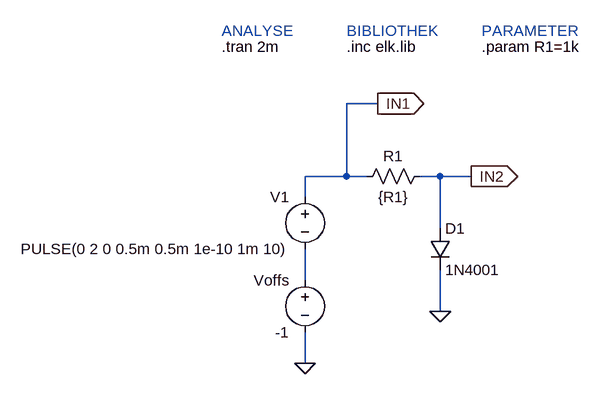
[diagram p0: schematic Activity_19_1N4001.asc]
Activity_19_1N4001.asc, the LTspice schematic file:
Version 4
SHEET 1 1408 680
WIRE -864 -16 -912 -16
WIRE -912 96 -912 -16
WIRE -912 96 -976 96
WIRE -880 96 -912 96
WIRE -768 96 -800 96
WIRE -720 96 -768 96
WIRE -976 128 -976 96
WIRE -768 176 -768 96
WIRE -976 256 -976 208
WIRE -768 304 -768 240
WIRE -976 384 -976 336
FLAG -768 304 0
FLAG -720 96 IN2
IOPIN -720 96 Out
FLAG -864 -16 IN1
IOPIN -864 -16 Out
FLAG -976 384 0
SYMBOL res -784 80 R90
WINDOW 0 0 56 VBottom 2
WINDOW 3 32 56 VTop 2
SYMATTR InstName R1
SYMATTR Value {R1}
SYMBOL diode -784 176 R0
SYMATTR InstName D1
SYMATTR Value 1N4001
SYMBOL voltage -976 112 M0
WINDOW 123 0 0 Left 0
WINDOW 39 0 0 Left 0
SYMATTR InstName V1
SYMATTR Value PULSE(0 2 0 0.5m 0.5m 1e-10 1m 10)
SYMBOL voltage -976 240 M0
SYMATTR InstName Voffs
SYMATTR Value -1
TEXT -704 -104 Left 2 !.param R1=1k
TEXT -1104 -104 Left 2 !.tran 2m
TEXT -912 -104 Left 2 !.inc elk.lib
TEXT -1104 -128 Left 2 ;ANALYSE
TEXT -912 -128 Left 2 ;BIBLIOTHEK
TEXT -704 -128 Left 2 ;PARAMETER

The netlist it stands for:
* Activity_19_1N4001.asc
R1 IN2 IN1 {R1}
D1 IN2 0 1N4001
V1 IN1 N001 PULSE(0 2 0 0.5m 0.5m 1e-10 1m 10)
Voffs N001 0 -1
.model D D
.lib standard.dio
.param R1=1k
.tran 2m
.inc elk.lib
* ANALYSE
* BIBLIOTHEK
* PARAMETER
.backanno
.end